# EAGLE schematic MusselGapeTracker_RevD (EAGLE 7.5.0)
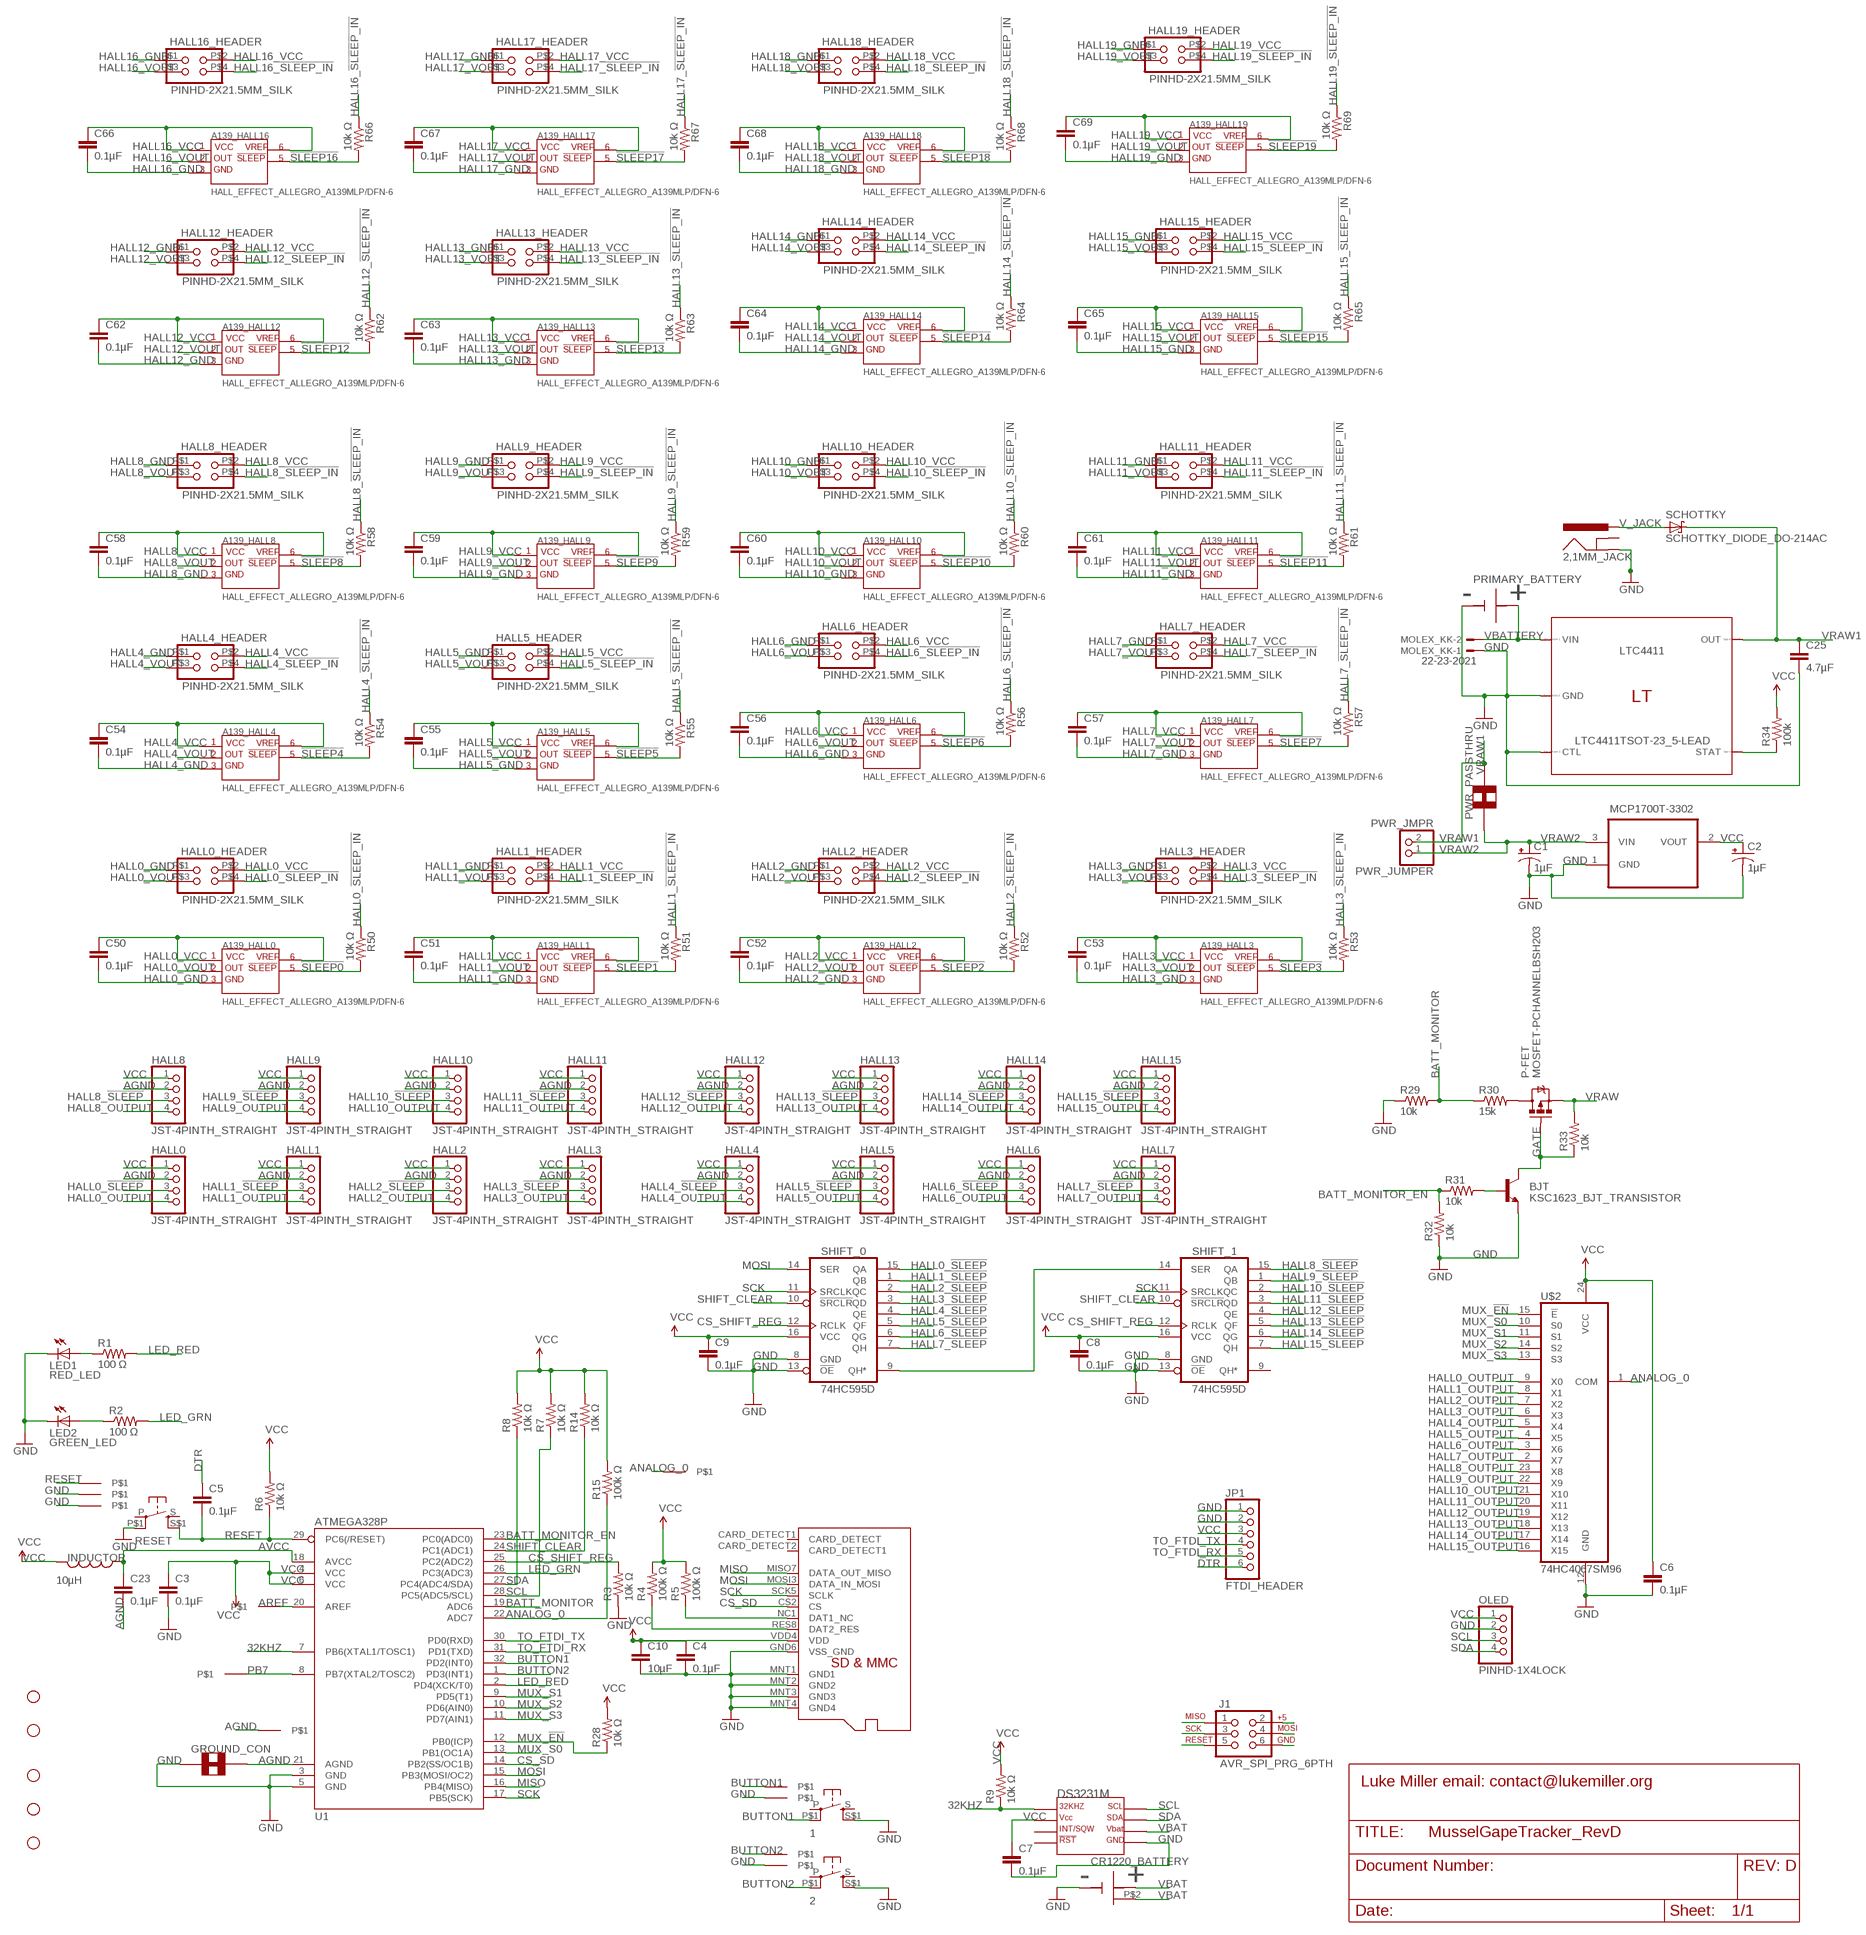
[diagram p0: schematic, sheet 1]

## Parts
1  PUSHBUTTON_DPST_SMDSTANDARD  [PUSHBUTTON_DPST_SMD]
2  PUSHBUTTON_DPST_SMDSTANDARD  [PUSHBUTTON_DPST_SMD]
2,1MM_JACK  POWER_JACK_2,1MM  [POWER_JACK_DC_2,1MM]
A139_HALL0  HALL_EFFECT_ALLEGRO_A139MLP/DFN-6  [A139*_HALL_EFFECT]
A139_HALL1  HALL_EFFECT_ALLEGRO_A139MLP/DFN-6  [A139*_HALL_EFFECT]
A139_HALL2  HALL_EFFECT_ALLEGRO_A139MLP/DFN-6  [A139*_HALL_EFFECT]
A139_HALL3  HALL_EFFECT_ALLEGRO_A139MLP/DFN-6  [A139*_HALL_EFFECT]
A139_HALL4  HALL_EFFECT_ALLEGRO_A139MLP/DFN-6  [A139*_HALL_EFFECT]
A139_HALL5  HALL_EFFECT_ALLEGRO_A139MLP/DFN-6  [A139*_HALL_EFFECT]
A139_HALL6  HALL_EFFECT_ALLEGRO_A139MLP/DFN-6  [A139*_HALL_EFFECT]
A139_HALL7  HALL_EFFECT_ALLEGRO_A139MLP/DFN-6  [A139*_HALL_EFFECT]
A139_HALL8  HALL_EFFECT_ALLEGRO_A139MLP/DFN-6  [A139*_HALL_EFFECT]
A139_HALL9  HALL_EFFECT_ALLEGRO_A139MLP/DFN-6  [A139*_HALL_EFFECT]
A139_HALL10  HALL_EFFECT_ALLEGRO_A139MLP/DFN-6  [A139*_HALL_EFFECT]
A139_HALL11  HALL_EFFECT_ALLEGRO_A139MLP/DFN-6  [A139*_HALL_EFFECT]
A139_HALL12  HALL_EFFECT_ALLEGRO_A139MLP/DFN-6  [A139*_HALL_EFFECT]
A139_HALL13  HALL_EFFECT_ALLEGRO_A139MLP/DFN-6  [A139*_HALL_EFFECT]
A139_HALL14  HALL_EFFECT_ALLEGRO_A139MLP/DFN-6  [A139*_HALL_EFFECT]
A139_HALL15  HALL_EFFECT_ALLEGRO_A139MLP/DFN-6  [A139*_HALL_EFFECT]
A139_HALL16  HALL_EFFECT_ALLEGRO_A139MLP/DFN-6  [A139*_HALL_EFFECT]
A139_HALL17  HALL_EFFECT_ALLEGRO_A139MLP/DFN-6  [A139*_HALL_EFFECT]
A139_HALL18  HALL_EFFECT_ALLEGRO_A139MLP/DFN-6  [A139*_HALL_EFFECT]
A139_HALL19  HALL_EFFECT_ALLEGRO_A139MLP/DFN-6  [A139*_HALL_EFFECT]
BJT  KSC1623_BJT_TRANSISTOR  [SOT23]
C1  1µF  CPOL-USB  [PANASONIC_B]
C2  1µF  CPOL-USB  [PANASONIC_B]
C3  0.1µF  CAP0603  [0603]
C4  0.1µF  CAP0603  [0603]
C5  0.1µF  CAP0603  [0603]
C6  0.1µF  CAP0603  [0603]
C7  0.1µF  CAP0603  [0603]
C8  0.1µF  CAP0603  [0603]
C9  0.1µF  CAP0603  [0603]
C10  10µF  CAP0603  [0603]
C23  0.1µF  CAP0603  [0603]
C25  4.7µF  CAP0603  [0603]
C50  0.1µF  CAP0603  [0603]
C51  0.1µF  CAP0603  [0603]
C52  0.1µF  CAP0603  [0603]
C53  0.1µF  CAP0603  [0603]
C54  0.1µF  CAP0603  [0603]
C55  0.1µF  CAP0603  [0603]
C56  0.1µF  CAP0603  [0603]
C57  0.1µF  CAP0603  [0603]
C58  0.1µF  CAP0603  [0603]
C59  0.1µF  CAP0603  [0603]
C60  0.1µF  CAP0603  [0603]
C61  0.1µF  CAP0603  [0603]
C62  0.1µF  CAP0603  [0603]
C63  0.1µF  CAP0603  [0603]
C64  0.1µF  CAP0603  [0603]
C65  0.1µF  CAP0603  [0603]
C66  0.1µF  CAP0603  [0603]
C67  0.1µF  CAP0603  [0603]
C68  0.1µF  CAP0603  [0603]
C69  0.1µF  CAP0603  [0603]
CR1220_BATTERY  CR1220_BATTERY_HOLDERSMD  [CR1220_BATTERY_HOLDER_SMD]
DS3231M  DS3231MSOIC-8  [DS3231M_SOIC8]
GND  PINHD-1X1SMALL  [1X01_SMALL]
GROUND_CON  SOLDER_JUMPER_TRACESTANDARD  [SJ_2S-TRACE]
HALL0  JST-4PINTH_STRAIGHT  [JST-PH-4-THM]
HALL0_HEADER  PINHD-2X21.5MM_SILK  [2X2_1.5MM]
HALL1  JST-4PINTH_STRAIGHT  [JST-PH-4-THM]
HALL1_HEADER  PINHD-2X21.5MM_SILK  [2X2_1.5MM]
HALL2  JST-4PINTH_STRAIGHT  [JST-PH-4-THM]
HALL2_HEADER  PINHD-2X21.5MM_SILK  [2X2_1.5MM]
HALL3  JST-4PINTH_STRAIGHT  [JST-PH-4-THM]
HALL3_HEADER  PINHD-2X21.5MM_SILK  [2X2_1.5MM]
HALL4  JST-4PINTH_STRAIGHT  [JST-PH-4-THM]
HALL4_HEADER  PINHD-2X21.5MM_SILK  [2X2_1.5MM]
HALL5  JST-4PINTH_STRAIGHT  [JST-PH-4-THM]
HALL5_HEADER  PINHD-2X21.5MM_SILK  [2X2_1.5MM]
HALL6  JST-4PINTH_STRAIGHT  [JST-PH-4-THM]
HALL6_HEADER  PINHD-2X21.5MM_SILK  [2X2_1.5MM]
HALL7  JST-4PINTH_STRAIGHT  [JST-PH-4-THM]
HALL7_HEADER  PINHD-2X21.5MM_SILK  [2X2_1.5MM]
HALL8  JST-4PINTH_STRAIGHT  [JST-PH-4-THM]
HALL8_HEADER  PINHD-2X21.5MM_SILK  [2X2_1.5MM]
HALL9  JST-4PINTH_STRAIGHT  [JST-PH-4-THM]
HALL9_HEADER  PINHD-2X21.5MM_SILK  [2X2_1.5MM]
HALL10  JST-4PINTH_STRAIGHT  [JST-PH-4-THM]
HALL10_HEADER  PINHD-2X21.5MM_SILK  [2X2_1.5MM]
HALL11  JST-4PINTH_STRAIGHT  [JST-PH-4-THM]
HALL11_HEADER  PINHD-2X21.5MM_SILK  [2X2_1.5MM]
HALL12  JST-4PINTH_STRAIGHT  [JST-PH-4-THM]
HALL12_HEADER  PINHD-2X21.5MM_SILK  [2X2_1.5MM]
HALL13  JST-4PINTH_STRAIGHT  [JST-PH-4-THM]
HALL13_HEADER  PINHD-2X21.5MM_SILK  [2X2_1.5MM]
HALL14  JST-4PINTH_STRAIGHT  [JST-PH-4-THM]
HALL14_HEADER  PINHD-2X21.5MM_SILK  [2X2_1.5MM]
HALL15  JST-4PINTH_STRAIGHT  [JST-PH-4-THM]
HALL15_HEADER  PINHD-2X21.5MM_SILK  [2X2_1.5MM]
HALL16_HEADER  PINHD-2X21.5MM_SILK  [2X2_1.5MM]
HALL17_HEADER  PINHD-2X21.5MM_SILK  [2X2_1.5MM]
HALL18_HEADER  PINHD-2X21.5MM_SILK  [2X2_1.5MM]
HALL19_HEADER  PINHD-2X21.5MM_SILK  [2X2_1.5MM]
INDUCTOR  10µH  INDUCTOR0805_TY  [I_0805]
J1  AVR_SPI_PRG_6PTH  [2X3]
JP1  FTDI_HEADER  PINHD-1X6RA  [1X06-RIGHT_ANGLE]
LED1  RED_LED  LED0805  [CHIPLED_0805]
LED2  GREEN_LED  LED0805  [CHIPLED_0805]
LTC4411  LTC4411TSOT-23_5-LEAD  [TSOT-23_5-LEAD]
MCP1700T-3302  MCP1700T-3302E/TT  [SOT95P237X112-3N]
MOLEX_KK  22-23-2021  [22-23-2021]
OLED  PINHD-1X4LOCK  [1X04_LOCK]
P-FET  MOSFET-PCHANNELBSH203  [SOT23-3]
PB7  PINHD-1X1SMALL  [1X01_SMALL]
PRIMARY_BATTERY  BATTERY_4XAA  [BATTERY_4XAA_PTH]
PWR_JUMPER  PWR_JMPR  PINHD-1X2NOSILK  [1X02_NOSILK]
PWR_PASSTHRU  PWR  SOLDER_JUMPER_TRACESTANDARD  [SJ_2S-TRACE]
R1  100 Ω  RESISTOR_SMDR0603  [R0603]
R2  100 Ω  RESISTOR_SMDR0603  [R0603]
R3  10k Ω  RESISTOR_SMDR0603  [R0603]
R4  100k Ω  RESISTOR_SMDR0603  [R0603]
R5  100k Ω  RESISTOR_SMDR0603  [R0603]
R6  10k Ω  RESISTOR_SMDR0603  [R0603]
R7  10k Ω  RESISTOR_SMDR0603  [R0603]
R8  10k Ω  RESISTOR_SMDR0603  [R0603]
R9  10k Ω  RESISTOR_SMDR0603  [R0603]
R14  10k Ω  RESISTOR_SMDR0603  [R0603]
R15  100k Ω  RESISTOR_SMDR0603  [R0603]
R28  10k Ω  RESISTOR_SMDR0603  [R0603]
R29  10k  RESISTOR_SMDR0603  [R0603]
R30  15k  RESISTOR_SMDR0603  [R0603]
R31  10k  RESISTOR_SMDR0603  [R0603]
R32  10k  RESISTOR_SMDR0603  [R0603]
R33  10k  RESISTOR_SMDR0603  [R0603]
R34  100k  RESISTOR_SMDR0603  [R0603]
R50  10k Ω  RESISTOR_SMDR0603  [R0603]
R51  10k Ω  RESISTOR_SMDR0603  [R0603]
R52  10k Ω  RESISTOR_SMDR0603  [R0603]
R53  10k Ω  RESISTOR_SMDR0603  [R0603]
R54  10k Ω  RESISTOR_SMDR0603  [R0603]
R55  10k Ω  RESISTOR_SMDR0603  [R0603]
R56  10k Ω  RESISTOR_SMDR0603  [R0603]
R57  10k Ω  RESISTOR_SMDR0603  [R0603]
R58  10k Ω  RESISTOR_SMDR0603  [R0603]
R59  10k Ω  RESISTOR_SMDR0603  [R0603]
R60  10k Ω  RESISTOR_SMDR0603  [R0603]
R61  10k Ω  RESISTOR_SMDR0603  [R0603]
R62  10k Ω  RESISTOR_SMDR0603  [R0603]
R63  10k Ω  RESISTOR_SMDR0603  [R0603]
R64  10k Ω  RESISTOR_SMDR0603  [R0603]
R65  10k Ω  RESISTOR_SMDR0603  [R0603]
R66  10k Ω  RESISTOR_SMDR0603  [R0603]
R67  10k Ω  RESISTOR_SMDR0603  [R0603]
R68  10k Ω  RESISTOR_SMDR0603  [R0603]
R69  10k Ω  RESISTOR_SMDR0603  [R0603]
RESET  PUSHBUTTON_DPST_SMDSTANDARD  [PUSHBUTTON_DPST_SMD]
SCHOTTKY  SCHOTTKY_DIODE_DO-214AC  [DO214AC]
SHIFT_0  74HC595D  [SO16]
SHIFT_1  74HC595D  [SO16]
STANDOFF1  STAND-OFF4-40  [STAND-OFF]
STANDOFF2  STAND-OFF4-40  [STAND-OFF]
STANDOFF3  STAND-OFF4-40  [STAND-OFF]
STANDOFF4_M2  STAND-OFFM2  [STAND-OFF_M2]
STANDOFF5_M2  STAND-OFFM2  [STAND-OFF_M2]
U1  ATMEGA328P  ATMEGA328_SMT  [TQFP32-08]
U$1  MICROSD_MOLEX_REVERSECURRENT  [MICROSD_SOCKET_MOLEX_REVERSEMOUNT]
U$2  74HC4067SM96  [SSOP24]
U$3  PINHD-1X1SMALL  [1X01_SMALL]
U$4  PINHD-1X1SMALL  [1X01_SMALL]
U$6  PINHD-1X1SMALL  [1X01_SMALL]
U$7  PINHD-1X1SMALL  [1X01_SMALL]
U$8  PINHD-1X1SMALL  [1X01_SMALL]
U$9  PINHD-1X1SMALL  [1X01_SMALL]
U$10  PINHD-1X1SMALL  [1X01_SMALL]
U$11  PINHD-1X1SMALL  [1X01_SMALL]
U$17  PINHD-1X1SMALL  [1X01_SMALL]

## Nets
32KHZ: DS3231M.1(P$1_32KHZ) R9.1 U1.7(PB6(XTAL1/TOSC1))
!SLEEP0: A139_HALL0.P$5 R50.2
!SLEEP1: A139_HALL1.P$5 R51.2
!SLEEP2: A139_HALL2.P$5 R52.2
!SLEEP3: A139_HALL3.P$5 R53.2
!SLEEP4: A139_HALL4.P$5 R54.2
!SLEEP5: A139_HALL5.P$5 R55.2
!SLEEP6: A139_HALL6.P$5 R56.2
!SLEEP7: A139_HALL7.P$5 R57.2
!SLEEP8: A139_HALL8.P$5 R58.2
!SLEEP9: A139_HALL9.P$5 R59.2
!SLEEP10: A139_HALL10.P$5 R60.2
!SLEEP11: A139_HALL11.P$5 R61.2
!SLEEP12: A139_HALL12.P$5 R62.2
!SLEEP13: A139_HALL13.P$5 R63.2
!SLEEP14: A139_HALL14.P$5 R64.2
!SLEEP15: A139_HALL15.P$5 R65.2
!SLEEP16: A139_HALL16.P$5 R66.2
!SLEEP17: A139_HALL17.P$5 R67.2
!SLEEP18: A139_HALL18.P$5 R68.2
!SLEEP19: A139_HALL19.P$5 R69.2
AGND: C23.2 GROUND_CON.2 HALL0.2 HALL1.2 HALL2.2 HALL3.2 HALL4.2 HALL5.2 HALL6.2 HALL7.2 HALL8.2 HALL9.2 HALL10.2 HALL11.2 HALL12.2 HALL13.2 HALL14.2 HALL15.2 U1.21(AGND) U$11.1
ANALOG_0: R15.1 U1.22(ADC7) U$2.1(COM) U$10.1
AREF: U1.20(AREF) U$17.1
AVCC: C23.1 INDUCTOR.P$1 U1.18(AVCC)
BATT_MONITOR: R29.2 R30.1 U1.19(ADC6)
BATT_MONITOR_EN: R31.1 R32.2 U1.23(PC0(ADC0))
BUTTON1: 1.P$1(P1) U1.32(PD2(INT0)) U$6.1
BUTTON2: 2.P$1(P1) U1.1(PD3(INT1)) U$8.1
CS_SD: U1.14(PB2(SS/OC1B)) U$1.CS2(CS)
CS_SHIFT_REG: R3.2 SHIFT_0.12(RCLK) SHIFT_1.12(RCLK) U1.25(PC2(ADC2))
DTR: C5.1 JP1.6
GATE: BJT.3(C) P-FET.1(G) R33.1
GND: 1.S$1(S1) 2,1MM_JACK.P$2(GND) 2.S$1(S1) BJT.2(E) C1.- C2.- C3.2 C4.2 C6.2 C7.2 C8.2 C9.2 C10.2 C25.2 CR1220_BATTERY.GND DS3231M.5(P$5_GND) GND.1 GROUND_CON.1 J1.6 JP1.1 JP1.2 LED1.C LED2.C LTC4411.2(GND) LTC4411.3(CTL) MCP1700T-3302.1(GND) MOLEX_KK.1 OLED.2 PRIMARY_BATTERY.GND R3.1 R29.1 R32.1 RESET.P$1(P1) SHIFT_0.8(GND) SHIFT_0.13(!OE) SHIFT_1.8(GND) SHIFT_1.13(!OE) U1.3(GND) U1.5(GND) U$1.GND6(VSS_GND) U$1.MNT1(GND1) U$1.MNT2(GND2) U$1.MNT3(GND3) U$1.MNT4(GND4) U$2.12(GND) U$4.1 U$7.1 U$9.1
HALL0_!SLEEP: HALL0.3 SHIFT_0.15(QA)
HALL0_!SLEEP_IN: HALL0_HEADER.P$4 R50.1
HALL0_GND: A139_HALL0.P$3_4 C50.2 HALL0_HEADER.P$1
HALL0_OUTPUT: HALL0.4 U$2.9(X0)
HALL0_VCC: A139_HALL0.P$1 A139_HALL0.P$6 C50.1 HALL0_HEADER.P$2
HALL0_VOUT: A139_HALL0.P$2 HALL0_HEADER.P$3
HALL1_!SLEEP: HALL1.3 SHIFT_0.1(QB)
HALL1_!SLEEP_IN: HALL1_HEADER.P$4 R51.1
HALL1_GND: A139_HALL1.P$3_4 C51.2 HALL1_HEADER.P$1
HALL1_OUTPUT: HALL1.4 U$2.8(X1)
HALL1_VCC: A139_HALL1.P$1 A139_HALL1.P$6 C51.1 HALL1_HEADER.P$2
HALL1_VOUT: A139_HALL1.P$2 HALL1_HEADER.P$3
HALL2_!SLEEP: HALL2.3 SHIFT_0.2(QC)
HALL2_!SLEEP_IN: HALL2_HEADER.P$4 R52.1
HALL2_GND: A139_HALL2.P$3_4 C52.2 HALL2_HEADER.P$1
HALL2_OUTPUT: HALL2.4 U$2.7(X2)
HALL2_VCC: A139_HALL2.P$1 A139_HALL2.P$6 C52.1 HALL2_HEADER.P$2
HALL2_VOUT: A139_HALL2.P$2 HALL2_HEADER.P$3
HALL3_!SLEEP: HALL3.3 SHIFT_0.3(QD)
HALL3_!SLEEP_IN: HALL3_HEADER.P$4 R53.1
HALL3_GND: A139_HALL3.P$3_4 C53.2 HALL3_HEADER.P$1
HALL3_OUTPUT: HALL3.4 U$2.6(X3)
HALL3_VCC: A139_HALL3.P$1 A139_HALL3.P$6 C53.1 HALL3_HEADER.P$2
HALL3_VOUT: A139_HALL3.P$2 HALL3_HEADER.P$3
HALL4_!SLEEP: HALL4.3 SHIFT_0.4(QE)
HALL4_!SLEEP_IN: HALL4_HEADER.P$4 R54.1
HALL4_GND: A139_HALL4.P$3_4 C54.2 HALL4_HEADER.P$1
HALL4_OUTPUT: HALL4.4 U$2.5(X4)
HALL4_VCC: A139_HALL4.P$1 A139_HALL4.P$6 C54.1 HALL4_HEADER.P$2
HALL4_VOUT: A139_HALL4.P$2 HALL4_HEADER.P$3
HALL5_!SLEEP: HALL5.3 SHIFT_0.5(QF)
HALL5_!SLEEP_IN: HALL5_HEADER.P$4 R55.1
HALL5_GND: A139_HALL5.P$3_4 C55.2 HALL5_HEADER.P$1
HALL5_OUTPUT: HALL5.4 U$2.4(X5)
HALL5_VCC: A139_HALL5.P$1 A139_HALL5.P$6 C55.1 HALL5_HEADER.P$2
HALL5_VOUT: A139_HALL5.P$2 HALL5_HEADER.P$3
HALL6_!SLEEP: HALL6.3 SHIFT_0.6(QG)
HALL6_!SLEEP_IN: HALL6_HEADER.P$4 R56.1
HALL6_GND: A139_HALL6.P$3_4 C56.2 HALL6_HEADER.P$1
HALL6_OUTPUT: HALL6.4 U$2.3(X6)
HALL6_VCC: A139_HALL6.P$1 A139_HALL6.P$6 C56.1 HALL6_HEADER.P$2
HALL6_VOUT: A139_HALL6.P$2 HALL6_HEADER.P$3
HALL7_!SLEEP: HALL7.3 SHIFT_0.7(QH)
HALL7_!SLEEP_IN: HALL7_HEADER.P$4 R57.1
HALL7_GND: A139_HALL7.P$3_4 C57.2 HALL7_HEADER.P$1
HALL7_OUTPUT: HALL7.4 U$2.2(X7)
HALL7_VCC: A139_HALL7.P$1 A139_HALL7.P$6 C57.1 HALL7_HEADER.P$2
HALL7_VOUT: A139_HALL7.P$2 HALL7_HEADER.P$3
HALL8_!SLEEP: HALL8.3 SHIFT_1.15(QA)
HALL8_!SLEEP_IN: HALL8_HEADER.P$4 R58.1
HALL8_GND: A139_HALL8.P$3_4 C58.2 HALL8_HEADER.P$1
HALL8_OUTPUT: HALL8.4 U$2.23(X8)
HALL8_VCC: A139_HALL8.P$1 A139_HALL8.P$6 C58.1 HALL8_HEADER.P$2
HALL8_VOUT: A139_HALL8.P$2 HALL8_HEADER.P$3
HALL9_!SLEEP: HALL9.3 SHIFT_1.1(QB)
HALL9_!SLEEP_IN: HALL9_HEADER.P$4 R59.1
HALL9_GND: A139_HALL9.P$3_4 C59.2 HALL9_HEADER.P$1
HALL9_OUTPUT: HALL9.4 U$2.22(X9)
HALL9_VCC: A139_HALL9.P$1 A139_HALL9.P$6 C59.1 HALL9_HEADER.P$2
HALL9_VOUT: A139_HALL9.P$2 HALL9_HEADER.P$3
HALL10_!SLEEP: HALL10.3 SHIFT_1.2(QC)
HALL10_!SLEEP_IN: HALL10_HEADER.P$4 R60.1
HALL10_GND: A139_HALL10.P$3_4 C60.2 HALL10_HEADER.P$1
HALL10_OUTPUT: HALL10.4 U$2.21(X10)
HALL10_VCC: A139_HALL10.P$1 A139_HALL10.P$6 C60.1 HALL10_HEADER.P$2
HALL10_VOUT: A139_HALL10.P$2 HALL10_HEADER.P$3
HALL11_!SLEEP: HALL11.3 SHIFT_1.3(QD)
HALL11_!SLEEP_IN: HALL11_HEADER.P$4 R61.1
HALL11_GND: A139_HALL11.P$3_4 C61.2 HALL11_HEADER.P$1
HALL11_OUTPUT: HALL11.4 U$2.20(X11)
HALL11_VCC: A139_HALL11.P$1 A139_HALL11.P$6 C61.1 HALL11_HEADER.P$2
HALL11_VOUT: A139_HALL11.P$2 HALL11_HEADER.P$3
HALL12_!SLEEP: HALL12.3 SHIFT_1.4(QE)
HALL12_!SLEEP_IN: HALL12_HEADER.P$4 R62.1
HALL12_GND: A139_HALL12.P$3_4 C62.2 HALL12_HEADER.P$1
HALL12_OUTPUT: HALL12.4 U$2.19(X12)
HALL12_VCC: A139_HALL12.P$1 A139_HALL12.P$6 C62.1 HALL12_HEADER.P$2
HALL12_VOUT: A139_HALL12.P$2 HALL12_HEADER.P$3
HALL13_!SLEEP: HALL13.3 SHIFT_1.5(QF)
HALL13_!SLEEP_IN: HALL13_HEADER.P$4 R63.1
HALL13_GND: A139_HALL13.P$3_4 C63.2 HALL13_HEADER.P$1
HALL13_OUTPUT: HALL13.4 U$2.18(X13)
HALL13_VCC: A139_HALL13.P$1 A139_HALL13.P$6 C63.1 HALL13_HEADER.P$2
HALL13_VOUT: A139_HALL13.P$2 HALL13_HEADER.P$3
HALL14_!SLEEP: HALL14.3 SHIFT_1.6(QG)
HALL14_!SLEEP_IN: HALL14_HEADER.P$4 R64.1
HALL14_GND: A139_HALL14.P$3_4 C64.2 HALL14_HEADER.P$1
HALL14_OUTPUT: HALL14.4 U$2.17(X14)
HALL14_VCC: A139_HALL14.P$1 A139_HALL14.P$6 C64.1 HALL14_HEADER.P$2
HALL14_VOUT: A139_HALL14.P$2 HALL14_HEADER.P$3
HALL15_!SLEEP: HALL15.3 SHIFT_1.7(QH)
HALL15_!SLEEP_IN: HALL15_HEADER.P$4 R65.1
HALL15_GND: A139_HALL15.P$3_4 C65.2 HALL15_HEADER.P$1
HALL15_OUTPUT: HALL15.4 U$2.16(X15)
HALL15_VCC: A139_HALL15.P$1 A139_HALL15.P$6 C65.1 HALL15_HEADER.P$2
HALL15_VOUT: A139_HALL15.P$2 HALL15_HEADER.P$3
HALL16_!SLEEP_IN: HALL16_HEADER.P$4 R66.1
HALL16_GND: A139_HALL16.P$3_4 C66.2 HALL16_HEADER.P$1
HALL16_VCC: A139_HALL16.P$1 A139_HALL16.P$6 C66.1 HALL16_HEADER.P$2
HALL16_VOUT: A139_HALL16.P$2 HALL16_HEADER.P$3
HALL17_!SLEEP_IN: HALL17_HEADER.P$4 R67.1
HALL17_GND: A139_HALL17.P$3_4 C67.2 HALL17_HEADER.P$1
HALL17_VCC: A139_HALL17.P$1 A139_HALL17.P$6 C67.1 HALL17_HEADER.P$2
HALL17_VOUT: A139_HALL17.P$2 HALL17_HEADER.P$3
HALL18_!SLEEP_IN: HALL18_HEADER.P$4 R68.1
HALL18_GND: A139_HALL18.P$3_4 C68.2 HALL18_HEADER.P$1
HALL18_VCC: A139_HALL18.P$1 A139_HALL18.P$6 C68.1 HALL18_HEADER.P$2
HALL18_VOUT: A139_HALL18.P$2 HALL18_HEADER.P$3
HALL19_!SLEEP_IN: HALL19_HEADER.P$4 R69.1
HALL19_GND: A139_HALL19.P$3_4 C69.2 HALL19_HEADER.P$1
HALL19_VCC: A139_HALL19.P$1 A139_HALL19.P$6 C69.1 HALL19_HEADER.P$2
HALL19_VOUT: A139_HALL19.P$2 HALL19_HEADER.P$3
LED_GRN: R2.2 U1.26(PC3(ADC3))
LED_RED: R1.2 U1.2(PD4(XCK/T0))
MISO: J1.1 U1.16(PB4(MISO)) U$1.MISO7(DATA_OUT_MISO)
MOSI: J1.4 SHIFT_0.14(SER) U1.15(PB3(MOSI/OC2)) U$1.MOSI3(DATA_IN_MOSI)
MUX_!EN: R28.1 U1.12(PB0(ICP)) U$2.15(!E)
MUX_S0: U1.13(PB1(OC1A)) U$2.10(S0)
MUX_S1: U1.9(PD5(T1)) U$2.11(S1)
MUX_S2: U1.10(PD6(AIN0)) U$2.14(S2)
MUX_S3: U1.11(PD7(AIN1)) U$2.13(S3)
N$1: LTC4411.4(STAT) R34.1
N$2: LED1.A R1.1
N$3: BJT.1(B) R31.2
N$4: P-FET.3(D) R30.2
N$10: LED2.A R2.1
NC1: R5.1 U$1.NC1(DAT1_NC)
PB7: PB7.1 U1.8(PB7(XTAL2/TOSC2))
QH*: SHIFT_0.9(QH*) SHIFT_1.14(SER)
RES8: R4.1 U$1.RES8(DAT2_RES)
RESET: C5.2 J1.5 R6.1 RESET.S$1(S1) U1.29(PC6(/RESET)) U$3.1
SCK: J1.3 SHIFT_0.11(SRCLK) SHIFT_1.11(SRCLK) U1.17(PB5(SCK)) U$1.SCK5(SCLK)
SCL: DS3231M.8(P$8_SCL) OLED.3 R7.1 U1.28(PC5(ADC5/SCL))
SDA: DS3231M.7(P$7_SDA) OLED.4 R8.1 U1.27(PC4(ADC4/SDA))
SHIFT_CLEAR: R14.1 SHIFT_0.10(!SRCLR) SHIFT_1.10(!SRCLR) U1.24(PC1(ADC1))
TO_FTDI_RX: JP1.5 U1.31(PD1(TXD))
TO_FTDI_TX: JP1.4 U1.30(PD0(RXD))
V_JACK: 2,1MM_JACK.P$1(PWR) SCHOTTKY.A
VBAT: CR1220_BATTERY.P$1(VBAT) CR1220_BATTERY.P$2 DS3231M.6(P$6_VBAT)
VBATTERY: LTC4411.1(VIN) MOLEX_KK.2 PRIMARY_BATTERY.VBAT
VCC: C2.+ C3.1 C4.1 C6.1 C7.1 C8.1 C9.1 C10.1 DS3231M.2(P$2_VCC) HALL0.1 HALL1.1 HALL2.1 HALL3.1 HALL4.1 HALL5.1 HALL6.1 HALL7.1 HALL8.1 HALL9.1 HALL10.1 HALL11.1 HALL12.1 HALL13.1 HALL14.1 HALL15.1 INDUCTOR.P$2 J1.2 JP1.3 MCP1700T-3302.2(VOUT) OLED.1 R4.2 R5.2 R6.2 R7.2 R8.2 R9.2 R14.2 R15.2 R28.2 R34.2 SHIFT_0.16(VCC) SHIFT_1.16(VCC) U1.4(VCC) U1.6(VCC) U$1.VDD4(VDD) U$2.24(VCC)
VRAW: P-FET.2(S) R33.2
VRAW1: C25.1 LTC4411.5(OUT) PWR_JUMPER.2 PWR_PASSTHRU.2 SCHOTTKY.C
VRAW2: C1.+ MCP1700T-3302.3(VIN) PWR_JUMPER.1 PWR_PASSTHRU.1
Unconnected: 1.P 1.S 2,1MM_JACK.P$3(GNDBREAK) 2.P 2.S DS3231M.3(P$3_INT) DS3231M.4(P$4_RST) RESET.P RESET.S SHIFT_1.9(QH*) U$1.CARD_DETECT1(CARD_DETECT) U$1.CARD_DETECT2(CARD_DETECT1)

## Library data of the parts
1 2 RESET = miller:PUSHBUTTON_DPST_SMD: PUSHBUTTON DPST SMD Omron B3S-1000 Digikey PN SW836CT-ND This is your standard "hobbyist" style momentary pushbutton in a surface mount package.
2,1MM_JACK = miller:POWER_JACK_2,1MM: DC Power Jack, 2.1mm center pin. Digikey PN CP-202AH-ND
A139_HALL0 A139_HALL1-A139_HALL19 = miller:HALL_EFFECT_ALLEGRO_A139*: Allegro A139* series Hall effect sensors A1391 1.25mV/Gauss A1392 2.5 mV/G A1393 5 mV/G A1395 10 mV/G Example Digikey PN 620-1031-1-ND (A1391SE)
BJT = miller:KSC1623_BJT_TRANSISTOR: KSC1623 BJT NPN transistor - Fairchild Seminconductor KSC1623LMTF Digikey PN KSC1623LMTFCT-ND Mouser PN 512-KSC1623LMTF
C1 C2 = miller:CPOL-US: POLARIZED CAPACITOR, American symbol
C3-C10 C23 C25 C50-C69 = miller:CAP: Capacitor Standard surface mount ceramic capacitor and 0.1" leaded capacitor.
CR1220_BATTERY = miller:CR1220_BATTERY_HOLDER: CR1220 Battery Holder Keystone Part # 3001 Digikey 3001K-ND
DS3231M = miller:DS3231M: DS3231M real time clock Battery backup, 2.3V to 5.5V supply voltage 1Hz and 32.768kHz outputs NOTE: This is a slightly lower cost version of the regular DS3231S, with fewer clock frequency output options and slightly lower long-term time accuracy. It uses the same I2C communications protocol as the DS3231S, and is available in a small SOIC-8 package or Wide SOIC-16 (0.300") package. Maxim PN DS3231MZ+ SOIC-8 package Maxim PN DS3231M+ SOIC-16 Wide package
GND PB7 U$3 U$4 U$6-U$11 U$17 = miller:PINHD-1X1: Just a single pin header, useful for making test point or stand-alone header hole for normal 0.1" pitch through-hole header pins The SMALL footprint is 0.035" diameter, barely large enough for standard 0.1" pitch header pins. The SMALL_0.7 footprint is 1.056mm diameter, drill hole is 0.7mm, too small for 0.1" pitch header pins
GROUND_CON PWR_PASSTHRU = miller:SOLDER_JUMPER_TRACE: Solder jumper with trace Treat this like a zero ohm resistor. The trace can be cut with a knife.
HALL0 HALL1-HALL15 = miller:JST-4PIN: JST PH series male header pins 2.0 mm pitch Example JST PN: B4B-PH-K-S(LF)(SN) Example Digikey PN: 455-1706-ND Mates with JST PN: PHR-4, Digikey PN: 455-1164-ND
HALL0_HEADER HALL1_HEADER HALL2_HEADER HALL3_HEADER HALL4_HEADER HALL5_HEADER HALL6_HEADER HALL7_HEADER HALL8_HEADER HALL9_HEADER HALL10_HEADER HALL11_HEADER HALL12_HEADER HALL13_HEADER HALL14_HEADER HALL15_HEADER HALL16_HEADER HALL17_HEADER HALL18_HEADER HALL19_HEADER = miller:PINHD-2X2: 2x2 header Various pitches
INDUCTOR = Felicia_force_logger:INDUCTOR: Inductor Example: Taiyo Yuden PN LBR2012T100K
J1 = miller:AVR_SPI_PRG_6: AVR ISP 6 Pin This is the reduced ISP connector for AVR programming. Common on Arduino. This footprint will take up less PCB space and can be used with a 10-pin to 6-pin adapter such as SKU: BOB-08508 **Special note about "TEST_POINT" package. The stop mask is on the top side, so if you want your programming test points to be on the bottom of your board, make sure to place this package on the bottom side of the board. This also ensure that the orientation to program from the bottom side will be correct.
JP1 = miller:PINHD-1X6: PIN HEADER
LED1 LED2 = miller:LED: LEDs Standard schematic elements and footprints for 5mm, 3mm, 1206, and 0603 sized LEDs. 5mm - Spark Fun Electronics SKU : COM-00529 (and others)
LTC4411 = miller:LTC4411: 2.6A Low Loss Ideal diode in ThinSOT; SPICEMODEL: LTC4411.sub; VALUE2: LTC4411
MCP1700T-3302 = miller:MCP1700T-3302E/TT: Low Quiescent Current LDO 3.3V Microchip Technology PN MCP1700T-3302E Digikey PN MCP1700T3302ETTCT-ND; MPN: MCP1700T-3302E/TT; OC_FARNELL: 1296592; OC_NEWARK: 88H9817; PACKAGE: SOT23-3; SUPPLIER: Microchip
MOLEX_KK = miller:22-23-2021: Molex KK series .100" (2.54mm) Center Header - 2 Pin; MF: MOLEX; MPN: 22-23-2021; OC_FARNELL: 1462926; OC_NEWARK: 25C3832
OLED = miller:PINHD-1X4: 1x4 header, multiple pins spacings LOCK version has holes slightly staggered to help hold header in place while soldering. 0.1" is standard breadboard pitch 2mm pitch (0.079") and 0.05" pitch are rarer in hobbyist realm.
P-FET = miller:MOSFET-PCHANNEL: Generic PMOSFET IRLML2244 - TRANS-11153 (SOT-23 -20V -4.3A) (1.Gate 2.Source 3.Drain) FQP27P06 - COM-10349 <http://www.sparkfun.com/products/10349> (TO-220 -60V -27A) (1.Gate 2.Source 3.Drain) BSH203,215 P-Channel (SOT-23) (-30V, -0.47A); PROD_ID: TRANS-08285
PRIMARY_BATTERY = miller:BATTERY_4XAA: Battery holder 4xAA Plastic, through-hole mount, 4xAA. Keystone PN 2477
PWR_JUMPER = miller:PINHD-1X2: 1x2 pin header 0.1" spacing (2.54mm)
R1-R9 R14 R15 R28-R34 R50-R69 = miller:RESISTOR_SMD: RESISTOR, American symbol
SCHOTTKY = miller:SCHOTTKY_DIODE: Schottky diode Example Vishay SS12-E3/61T, Digikey PN SS12-E3/61TGICT-ND
SHIFT_0 SHIFT_1 = miller:74HC595: 74HC595 Shift register For example, Texas Instruments SN74HC595
STANDOFF1-STANDOFF3 STANDOFF4_M2 STANDOFF5_M2 = miller:STAND-OFF: #4 Stand Off This is the mechanical footprint for a #4 phillips button head screw. Use the keepout ring to avoid running the screw head into surrounding components. SKU : PRT-00447
U1 = miller:ATMEGA328_SMT: 32-Pin Atmega328
U$1 = miller:MICROSD_MOLEX_REVERSE: Molex micro SD connector, push-push spring loaded, "reverse" mount Pins accessible at rear of case. Active: Molex PN 5027740891 Digikey PN WM24066CT-ND Obsolete: Molex PN 49225-201
U$2 = miller:74HC4067: 74HC4067 16-channel multiplexer Example: Texas Instruments CD74HC4067M